# EAGLE design attiny1l_alt (EAGLE 6.2)
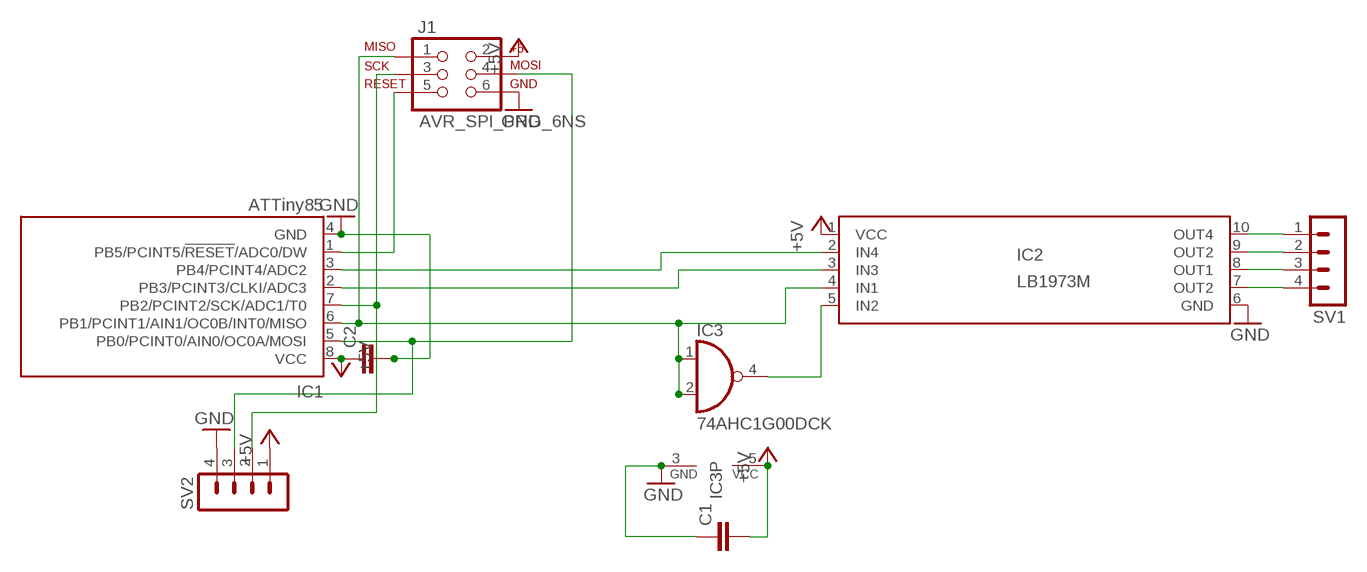
[diagram p0: schematic, sheet 1]

## Parts
C1  C-EUC0805  [C0805]
C2  C-EUC0805  [C0805]
IC1  ATTiny85  TINY13-20SU  [8S2]
IC2  LB1973M  [SSOP10]
IC3  74AHC1G00DCK  [SC70-5]
J1  AVR_SPI_PRG_6NS  [2X3-NS]
SV1  MA04-1  [MA04-1]
SV2  MA04-1  [MA04-1]

## Nets
+5V: C1.2 C2.1 IC1.8(VCC) IC2.1(VCC) IC3.5(VCC) J1.2 SV2.1
GND: C1.1 C2.2 IC1.4(GND) IC2.6(GND) IC3.3(GND) J1.6 SV2.4
IN1/MISO: IC1.6(PB1/PCINT1/AIN1/OC0B/INT0/MISO) IC2.4(IN1) IC3.1(I0) IC3.2(I1) J1.1
IN2: IC2.5(IN2) IC3.4(O)
IN3: IC1.2(PB3/PCINT3/CLKI/ADC3) IC2.3(IN3)
IN4: IC1.3(PB4/PCINT4/ADC2) IC2.2(IN4)
OUT1: IC2.8(OUT1) SV1.3
OUT2: IC2.7(OUT2) SV1.4
OUT3: IC2.9(OUT2) SV1.2
OUT4: IC2.10(OUT4) SV1.1
RESET-: IC1.1(PB5/PCINT5/!RESET!/ADC0/DW) J1.5
SCL/SCK: IC1.7(PB2/PCINT2/SCK/ADC1/T0) J1.3 SV2.2
SDA/MOSI: IC1.5(PB0/PCINT0/AIN0/OC0A/MOSI) J1.4 SV2.3

## Library data of the parts
C1 C2 = rcl:C-EU: CAPACITOR, European symbol
IC1 = atmel:TINY13: 8-bit AVR Microcontroller with 1K Bytes In-System Programmable Flash Source: http://www.atmel.com/dyn/resources/prod_documents/2535S.pdf; MPN: ATTINY13-20SU; OC_FARNELL: 9171568; OC_NEWARK: 96K6522
IC2 = LB1973M:LB1973M: edit this description Auto generated by make-symbol-device-package-bsdl.ulp Rev. 43 Source:
IC3 = 74xx-little-de:74*1G00: 2-input NAND gate
J1 = SparkFun-Connectors:AVR_SPI_PRG_6: AVR ISP 6 Pin This is the reduced ISP connector for AVR programming. Common on Arduino. This footprint will take up less PCB space and can be used with a 10-pin to 6-pin adapter such as SKU: BOB-08508
SV1 SV2 = con-lstb:MA04-1: PIN HEADER; OC_FARNELL: unknown; OC_NEWARK: unknown

## Board
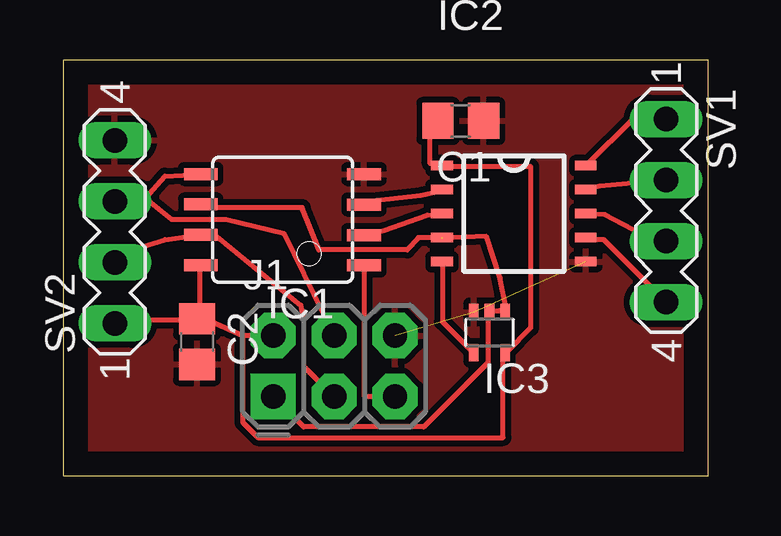
[diagram p1: board, top side]

Size 26.9 x 17.32 mm. Coordinates in mm from the lower left corner, seen from the top.
Outline: 0,0 26.9,0 26.9,17.32 0,17.32 0,0
Copper layers 1: Top 0.035mm
Design rules: minimum track width 8mil, minimum drill 24mil, track to track 8mil, track to pad 8mil, pad to pad 8mil, via to via 8mil, smd to smd 8mil, copper to edge 40mil, drill to drill 8mil, minimum pad ring 10mil, minimum via ring 8mil, stop-mask expansion 4mil, vias tented up to drill 0mil, thermal gap 10mil

### Footprints (pad centres in the part's own frame; a part is rotated, then mirrored left to right if it is on the bottom)
C0805 = smd 1.3 x 1.5: 1 -0.95,0; 2 0.95,0
8S2 = smd 0.5 x 1.4: 1 -1.905,-3.404; 2 -0.645,-3.404; 3 0.625,-3.404; 4 1.895,-3.404; 5 1.905,3.404; 6 0.635,3.404; 7 -0.635,3.404; 8 -1.905,3.404
SSOP10 = smd 0.9 x 0.4: 1 -2.996,2; 2 -2.996,1; 3 -2.996,0; 4 -2.996,-1; 5 -2.996,-2; 6 2.996,-2; 7 2.996,-1; 8 2.996,0; 9 2.996,1; 10 2.996,2
SC70-5 = smd 0.4 x 0.7: 1 -0.65,-0.85; 2 0,-0.85; 3 0.65,-0.85; 4 0.65,0.85; 5 -0.65,0.85
2X3-NS = drill 1.016 pad 1.88 square: 1 -2.54,-1.27 | drill 1.016 pad 1.88 octagon: 2 -2.54,1.27; 3 0,-1.27; 4 0,1.27; 5 2.54,-1.27; 6 2.54,1.27
MA04-1 = drill 1.016 long: 1 -3.81,0; 2 -1.27,0; 3 1.27,0; 4 3.81,0

### Placement (x,y rotation side)
C1  16.59,14.78 180 top
C2  5.59,5.59 270 top
IC1  9.14,10.67 90 top
IC2  18.8,10.92 0 top
IC3  17.78,5.97 180 top
J1  11.3,4.57 0 top
SV1  25.15,11.05 270 top
SV2  2.16,10.16 90 top

### Tracks (layer width: path | path; a pad name or v marks a point on that pad's centre or on a via)
+5V
  Top 0.203: C1.2 15.3,14.73 15.3,13.02 15.81,13.02 IC2.1 15.81,12.89 19.49,12.89 19.49,6.16 18.48,5.14 IC3.5 18.35,5.08 18.35,1.59 8.13,1.59 7.49,2.22 7.49,5.84 | IC1.8 5.71,8.76 5.71,6.54 C2.1 | J1.2 7.49,5.84 | 7.49,5.84 6.03,6.48 5.78,6.48 C2.1 | SV2.1 2.29,6.48 5.52,6.48 C2.1
GND  (2 unrouted)
  pour Top (isolate 0.254): 0,16.26 0,0 26.92,0 26.92,16.26
IN1/MISO  (1 unrouted)
  Top 0.203: IC3.2 17.78,6.86 18.41,6.86 IC3.1 | 15.81,9.91 17.65,9.97 18.22,8.26 18.48,6.92 IC3.2 | IC1.6 5.78,11.3 5.91,11.18 9.97,11.18 10.67,9.41 14.35,9.41 14.81,9.92 IC2.4 | J1.1 10.03,2.03 15.05,2.03 17.72,4.7 17.72,6.73 IC3.2
IN2
  Top 0.203: IC3.4 17.08,5.14 15.81,6.41 15.81,8.89 IC2.5
IN3
  Top 0.203: IC2.3 15.75,10.92 15.18,10.86 13.4,10.22 12.57,10.03 IC1.2
IN4
  Top 0.203: IC2.2 15.75,11.87 14.92,11.68 12.7,11.43 12.57,11.3 IC1.3
OUT1
  Top 0.203: SV1.3 24.14,10.07 22.59,10.88 21.84,10.92 IC2.8
OUT2
  Top 0.203: SV1.4 22.54,9.84 21.91,9.84 21.84,9.91 IC2.7
OUT3
  Top 0.203: SV1.2 22.38,12.06 21.84,11.94 IC2.9
OUT4
  Top 0.203: SV1.1 23.75,14.86 21.84,12.95 IC2.10
RESET-
  Top 0.203: J1.5 12.57,3.3 12.57,8.76 IC1.1
SCL/SCK
  Top 0.203: SV2.2 2.6,9.34 4.25,9.84 5.71,10.03 IC1.7 5.78,9.97 6.41,9.97 9.91,7.11 10.03,6.48 10.03,4.57 J1.3
SDA/MOSI
  Top 0.203: 3.45,11.57 2.6,11.87 SV2.3 | 3.45,11.57 4.25,12.48 5.71,12.57 IC1.5 | J1.4 9.21,10.1 6.79,10.68 4.53,10.68 3.45,11.56 3.45,11.57